# Altium project SolderingTC.PrjPcb
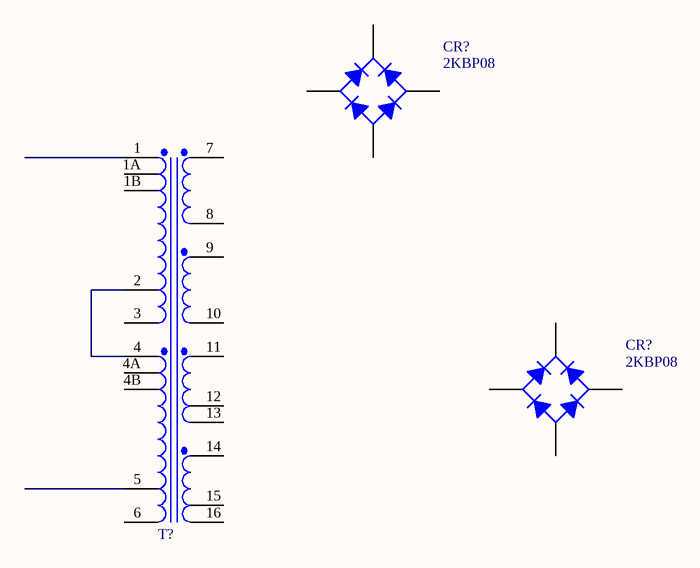
[diagram p0: SolderingTC.SchDoc]
1 sheet, 3 parts. Net scope: global (net labels, ports and power ports of the same name join across sheets).

## Sheet SolderingTC.SchDoc
size A4

### Parts
(Parts that share a designator on the sheet are numbered #1, #2 ... from top to bottom, then left to right.)
CR?#1  2KBP08  [D-44]
CR?#2  2KBP08  [D-44]
T?  TN36  (value not drawn)

### Nets
NetT?_2: T?.2 T?.4

Not connected (* = marked no-connect by the designer): CR?#1 1(K) 2(C) 3(C) 4(A); CR?#2 1(K) 2(C) 3(C) 4(A); T? 1 1A 1B 3 4A 4B 5 6 7 8 9 10 11 12 13 14 15 16

### Library data of the parts
CR?#1 CR?#2 = 2KBP08: 2 Amp Single Phase Rectifier Bridge; Published: 8-Jun-2000; LatestRevisionDate: 17-Jul-2002; LatestRevisionNote: Re-released for DXP Platform.; DatasheetVersion: E2753A; PackageReference: D-44; Publisher: Altium Limited; PackageDescription: SIP; 4 Leads; Body 15 x 17.5 x 6.8 mm (typ); Pitch 3.8 mm; ComponentLink1Description: Manufacturer Link; ComponentLink1URL: http://www.irf.com/; ComponentLink2Description: Datasheet; ComponentLink2URL: http://www.irf.com/product-info/datasheets/data/2kbb.pdf
T? = TN36: TN-36